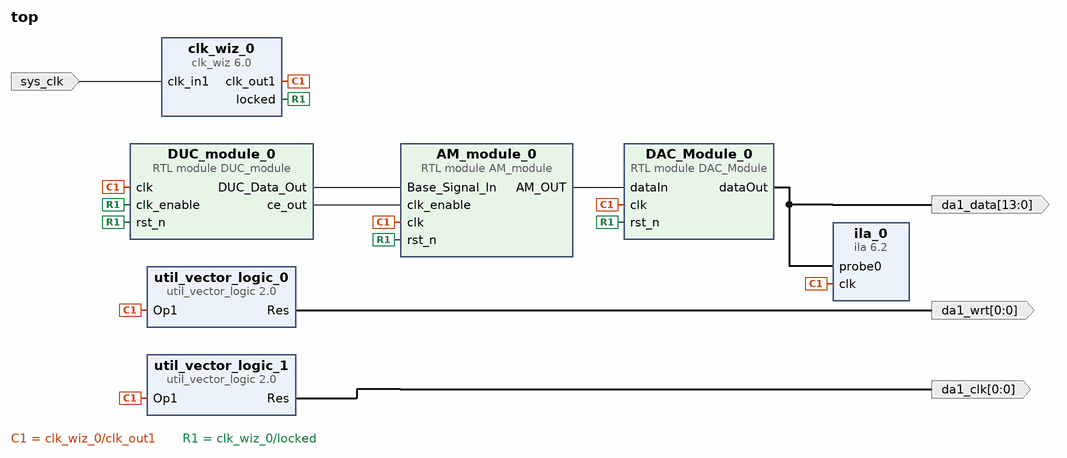
[diagram p0: block diagram of the top level]
# Vivado block design top, xc7z020clg400-2, Vivado 2023.2.2
create_bd_design top

create_bd_port -dir O -from 13 -to 0 da1_data
create_bd_port -dir O -from 0 -to 0 da1_wrt
create_bd_port -dir O -from 0 -to 0 da1_clk
create_bd_port -dir I -type clk sys_clk
set_property -dict {CONFIG.FREQ_HZ 50000000} [get_bd_ports sys_clk]

create_bd_cell -type module -reference DUC_module DUC_module_0
create_bd_cell -type module -reference AM_module AM_module_0
create_bd_cell -type module -reference DAC_Module DAC_Module_0
create_bd_cell -type ip -vlnv xilinx.com:ip:clk_wiz:6.0 clk_wiz_0
set_property -dict [list \
  CONFIG.CLKIN1_JITTER_PS 200.0 \
  CONFIG.CLKOUT1_DRIVES BUFG \
  CONFIG.CLKOUT1_JITTER 156.886 \
  CONFIG.CLKOUT1_PHASE_ERROR 160.484 \
  CONFIG.CLKOUT1_REQUESTED_OUT_FREQ 120 \
  CONFIG.CLKOUT2_DRIVES BUFG \
  CONFIG.CLKOUT3_DRIVES BUFG \
  CONFIG.CLKOUT4_DRIVES BUFG \
  CONFIG.CLKOUT5_DRIVES BUFG \
  CONFIG.CLKOUT6_DRIVES BUFG \
  CONFIG.CLKOUT7_DRIVES BUFG \
  CONFIG.FEEDBACK_SOURCE FDBK_AUTO \
  CONFIG.MMCM_CLKFBOUT_MULT_F 19.500 \
  CONFIG.MMCM_CLKIN1_PERIOD 20.000 \
  CONFIG.MMCM_CLKIN2_PERIOD 10.0 \
  CONFIG.MMCM_CLKOUT0_DIVIDE_F 8.125 \
  CONFIG.PRIM_IN_FREQ 50 \
  CONFIG.RESET_PORT reset \
  CONFIG.RESET_TYPE ACTIVE_LOW \
  CONFIG.USE_RESET false \
  CONFIG.USE_SAFE_CLOCK_STARTUP false \
] [get_bd_cells clk_wiz_0]
create_bd_cell -type ip -vlnv xilinx.com:ip:ila:6.2 ila_0
set_property -dict [list \
  CONFIG.C_DATA_DEPTH 32768 \
  CONFIG.C_INPUT_PIPE_STAGES 1 \
  CONFIG.C_MONITOR_TYPE Native \
  CONFIG.C_PROBE0_WIDTH 14 \
] [get_bd_cells ila_0]
create_bd_cell -type ip -vlnv xilinx.com:ip:util_vector_logic:2.0 util_vector_logic_0
set_property -dict {CONFIG.C_OPERATION not CONFIG.C_SIZE 1} [get_bd_cells util_vector_logic_0]
create_bd_cell -type ip -vlnv xilinx.com:ip:util_vector_logic:2.0 util_vector_logic_1
set_property -dict {CONFIG.C_OPERATION not CONFIG.C_SIZE 1} [get_bd_cells util_vector_logic_1]

# ---- connections ----

connect_bd_net [get_bd_pins AM_module_0/AM_OUT] [get_bd_pins DAC_Module_0/dataIn]
connect_bd_net [get_bd_pins DAC_Module_0/dataOut] [get_bd_ports da1_data] [get_bd_pins ila_0/probe0]
connect_bd_net [get_bd_pins DUC_module_0/DUC_Data_Out] [get_bd_pins AM_module_0/Base_Signal_In]
connect_bd_net [get_bd_pins DUC_module_0/ce_out] [get_bd_pins AM_module_0/clk_enable]
connect_bd_net -net clk_in1_0_1 [get_bd_ports sys_clk] [get_bd_pins clk_wiz_0/clk_in1]
connect_bd_net [get_bd_pins clk_wiz_0/clk_out1] \
  [get_bd_pins ila_0/clk] [get_bd_pins util_vector_logic_0/Op1] [get_bd_pins util_vector_logic_1/Op1] \
  [get_bd_pins DAC_Module_0/clk] [get_bd_pins AM_module_0/clk] [get_bd_pins DUC_module_0/clk]
connect_bd_net [get_bd_pins clk_wiz_0/locked] \
  [get_bd_pins DAC_Module_0/rst_n] [get_bd_pins AM_module_0/rst_n] [get_bd_pins DUC_module_0/rst_n] \
  [get_bd_pins DUC_module_0/clk_enable]
connect_bd_net [get_bd_pins util_vector_logic_0/Res] [get_bd_ports da1_wrt]
connect_bd_net [get_bd_pins util_vector_logic_1/Res] [get_bd_ports da1_clk]

validate_bd_design
save_bd_design
